# Altium schematic sheet Blocks.SchDoc
size A4; SheetNumber: 3; SheetTotal: 7
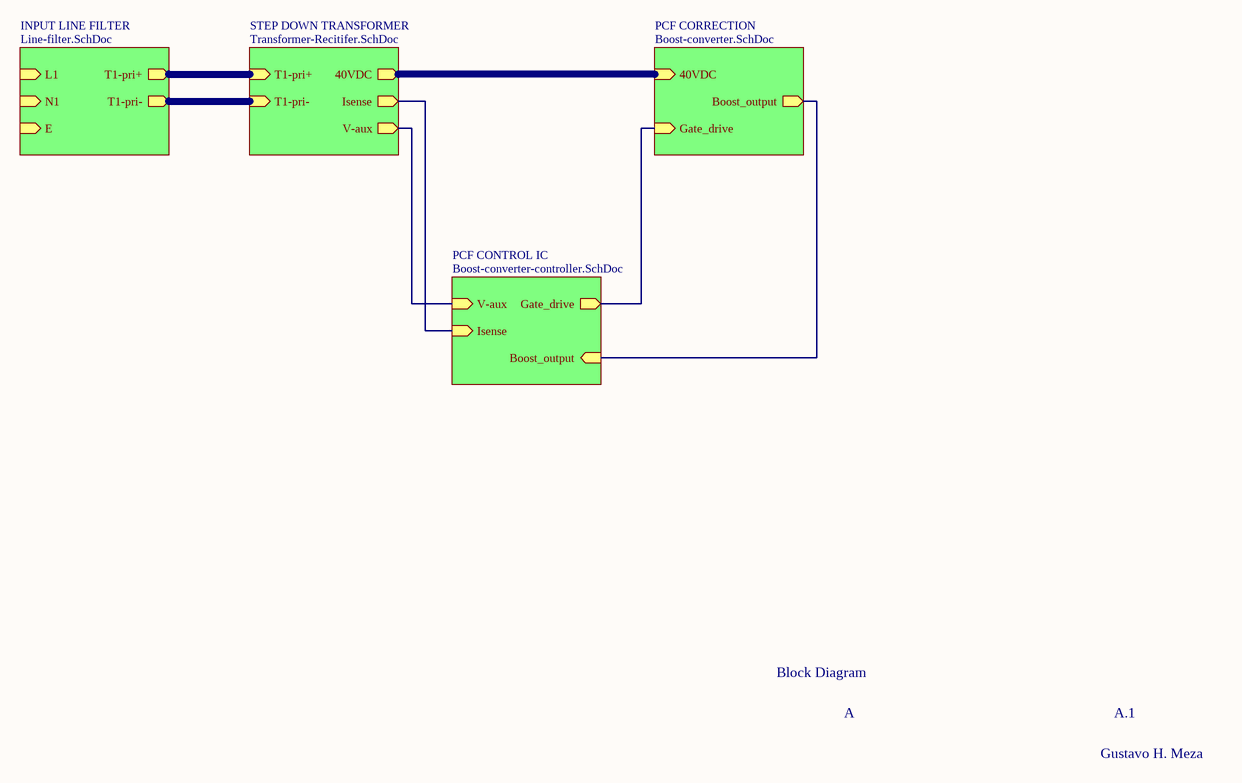
[diagram p0: Blocks.SchDoc]

## Sub-sheets
INPUT LINE FILTER = Line-filter.SchDoc: L1 (in), N1 (in), E (in), T1-pri+ (out), T1-pri- (out)
PCF CONTROL IC = Boost-converter-controller.SchDoc: Isense (in), V-aux (in), Gate_drive (out), Boost_output (in)
PCF CORRECTION = Boost-converter.SchDoc: Gate_drive (in), Boost_output (out), 40VDC (in)
STEP DOWN TRANSFORMER = Transformer-Recitifer.SchDoc: T1-pri- (in), T1-pri+ (in), 40VDC (out), V-aux (out), Isense (out)

## Nets
(unnamed): sheet INPUT LINE FILTER/T1-pri+, sheet STEP DOWN TRANSFORMER/T1-pri+
(unnamed): sheet INPUT LINE FILTER/T1-pri-, sheet STEP DOWN TRANSFORMER/T1-pri-
(unnamed): sheet STEP DOWN TRANSFORMER/40VDC, sheet PCF CORRECTION/40VDC
(unnamed): sheet STEP DOWN TRANSFORMER/V-aux, sheet PCF CONTROL IC/V-aux
(unnamed): sheet STEP DOWN TRANSFORMER/Isense, sheet PCF CONTROL IC/Isense
(unnamed): sheet PCF CONTROL IC/Gate_drive, sheet PCF CORRECTION/Gate_drive
(unnamed): sheet PCF CONTROL IC/Boost_output, sheet PCF CORRECTION/Boost_output

## Notes on the sheet
- Block Diagram
- A
- A.1
- Gustavo H. Meza